# EAGLE schematic Automaton (EAGLE 5.91)
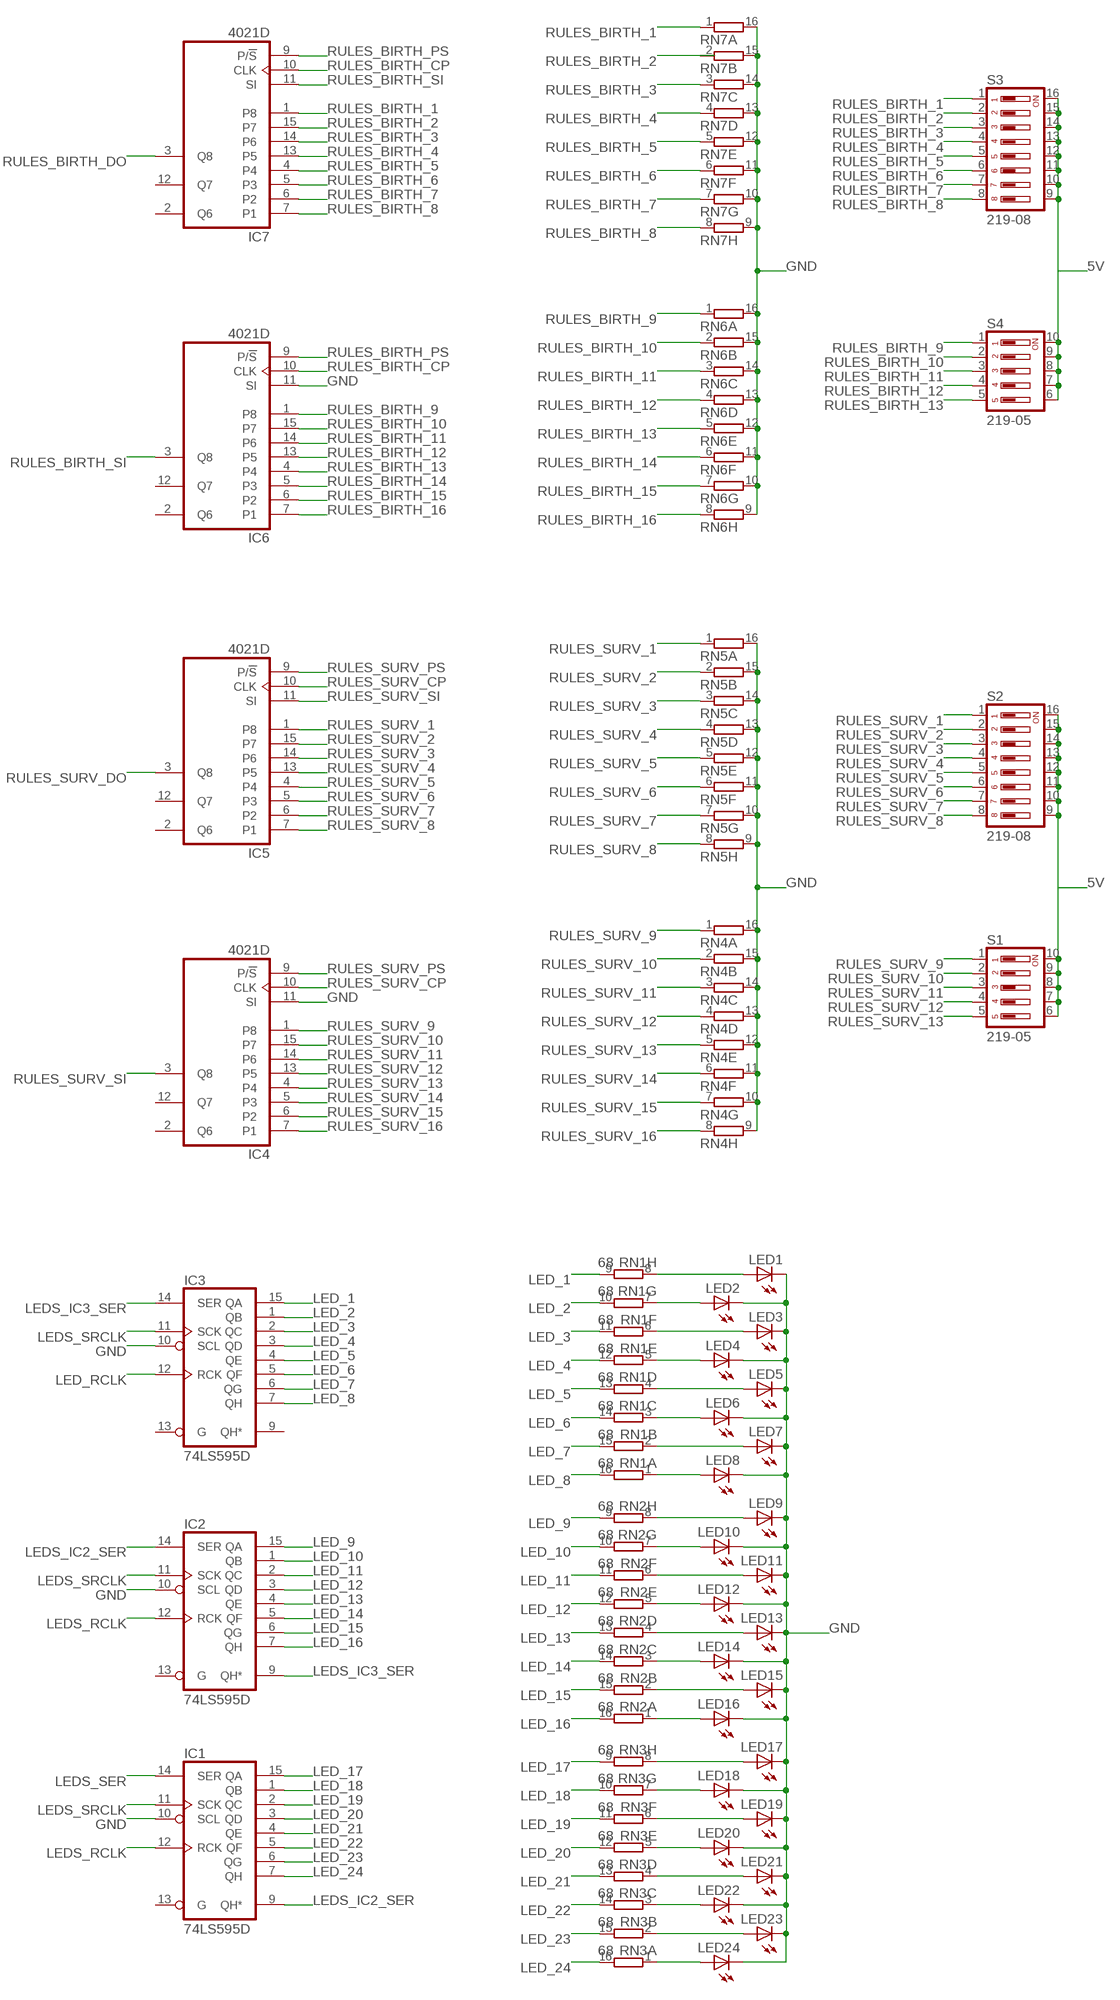
[diagram p0: schematic, sheet 1, part 1 of 2]
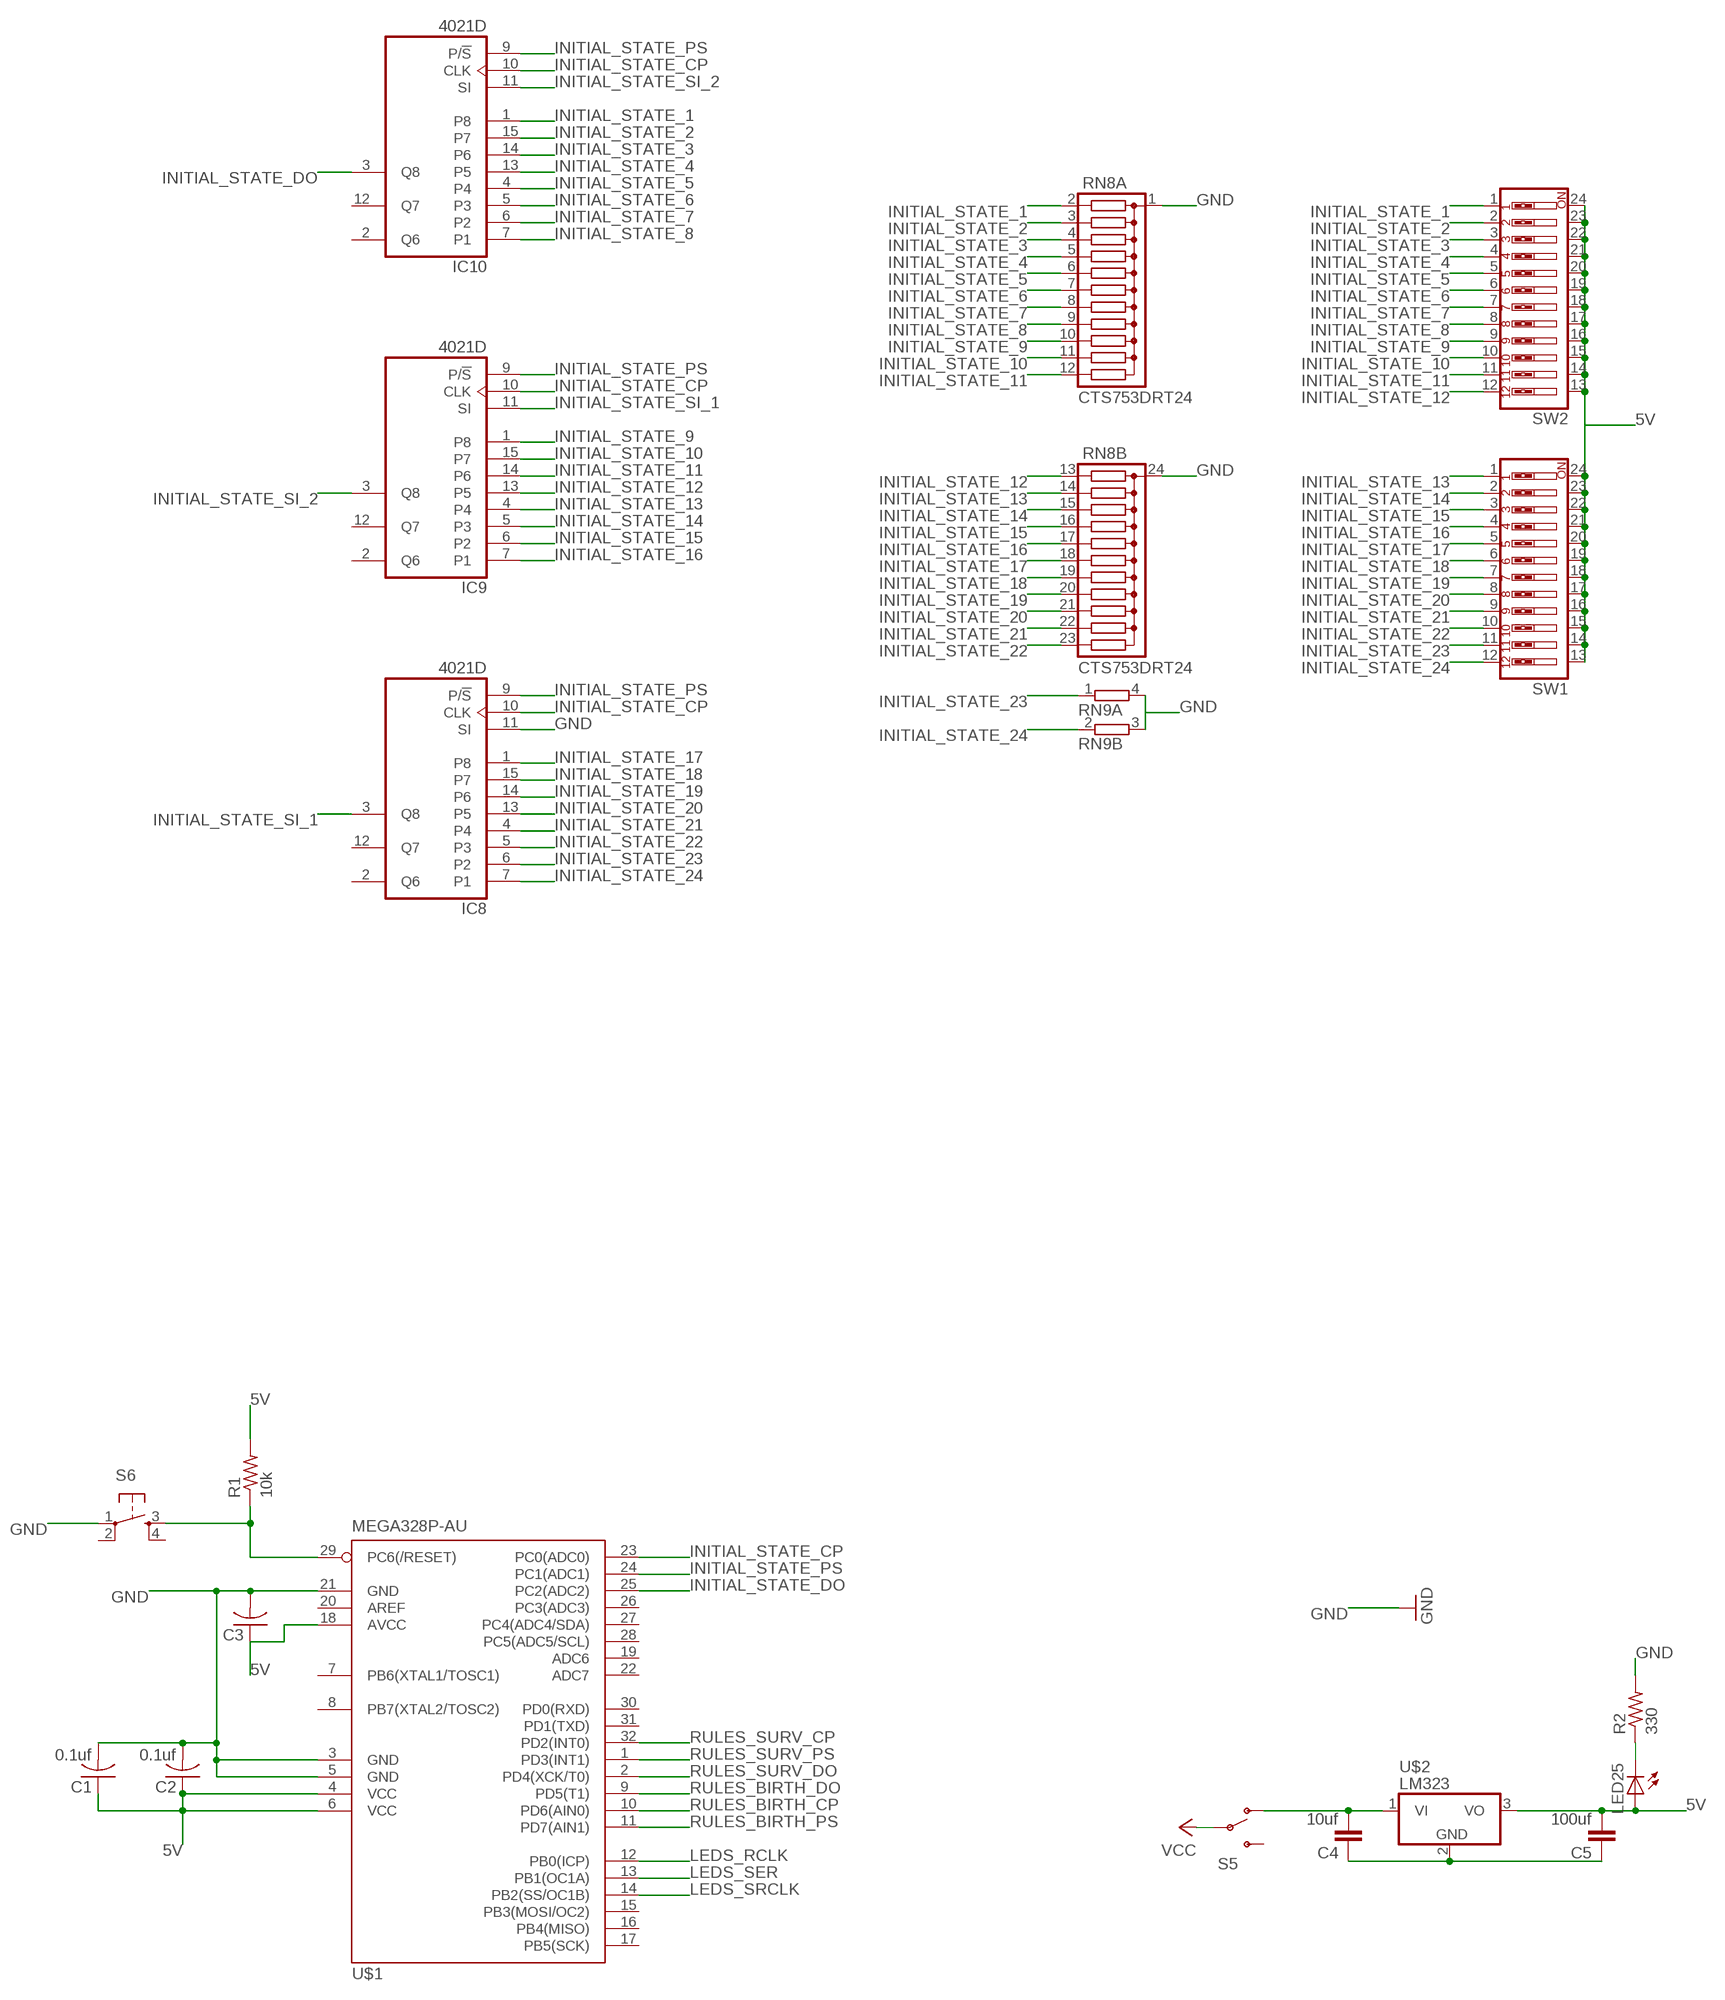
[diagram p1: schematic, sheet 1, part 2 of 2]

## Parts
C1  0.1uf  C-US025-024X044  [C025-024X044]
C2  0.1uf  C-US025-024X044  [C025-024X044]
C3  C-US025-024X044  [C025-024X044]
C4  10uf  CAP1210  [1210]
C5  100uf  CAP1210  [1210]
IC1  74LS595D  [SO16]
IC2  74LS595D  [SO16]
IC3  74LS595D  [SO16]
IC4  4021D  [SO16]
IC5  4021D  [SO16]
IC6  4021D  [SO16]
IC7  4021D  [SO16]
IC8  4021D  [SO16]
IC9  4021D  [SO16]
IC10  4021D  [SO16]
LED1  LED  [SMARTLED-TTW]
LED2  LED  [SMARTLED-TTW]
LED3  LED  [SMARTLED-TTW]
LED4  LED  [SMARTLED-TTW]
LED5  LED  [SMARTLED-TTW]
LED6  LED  [SMARTLED-TTW]
LED7  LED  [SMARTLED-TTW]
LED8  LED  [SMARTLED-TTW]
LED9  LED  [SMARTLED-TTW]
LED10  LED  [SMARTLED-TTW]
LED11  LED  [SMARTLED-TTW]
LED12  LED  [SMARTLED-TTW]
LED13  LED  [SMARTLED-TTW]
LED14  LED  [SMARTLED-TTW]
LED15  LED  [SMARTLED-TTW]
LED16  LED  [SMARTLED-TTW]
LED17  LED  [SMARTLED-TTW]
LED18  LED  [SMARTLED-TTW]
LED19  LED  [SMARTLED-TTW]
LED20  LED  [SMARTLED-TTW]
LED21  LED  [SMARTLED-TTW]
LED22  LED  [SMARTLED-TTW]
LED23  LED  [SMARTLED-TTW]
LED24  LED  [SMARTLED-TTW]
LED25  LED  [SMARTLED-TTW]
R1  10k  R-US_M0805  [M0805]
R2  330  R-US_0204/5  [0204/5]
RN1  68  8R-NSOMC  [SOMC16]
RN2  68  8R-NSOMC  [SOMC16]
RN3  68  8R-NSOMC  [SOMC16]
RN4  8R-NSOMC  [SOMC16]
RN5  8R-NSOMC  [SOMC16]
RN6  8R-NSOMC  [SOMC16]
RN7  8R-NSOMC  [SOMC16]
RN8  CTS753DRT24  [CTS753DRT24]
RN9  2R-NEXBV4V  [EXBV4V]
S1  219-05  [CTS-219-05]
S2  219-08  [CTS-219-08]
S3  219-08  [CTS-219-08]
S4  219-05  [CTS-219-05]
S5  SWITCH-SPSTPTH_LOCK  [SWITCH-SPDT_LOCK.007S]
S6  TAC_SWITCHSMD  [TACTILE_SWITCH_SMD]
SW1  SW_DIP-12  [EDG-12]
SW2  SW_DIP-12  [EDG-12]
U$1  MEGA328P-AU  [TQFP32-08]
U$2  LM323  [TO220H]

## Nets
5V: C1.1 C2.1 C3.1 C5.2 LED25.A@1(A) R1.2 S1.6 S1.7 S1.8 S1.9 S1.10 S2.9 S2.10 S2.11 S2.12 S2.13 S2.14 S2.15 S2.16 S3.9 S3.10 S3.11 S3.12 S3.13 S3.14 S3.15 S3.16 S4.6 S4.7 S4.8 S4.9 S4.10 SW1.13 SW1.14 SW1.15 SW1.16 SW1.17 SW1.18 SW1.19 SW1.20 SW1.21 SW1.22 SW1.23 SW1.24 SW2.13 SW2.14 SW2.15 SW2.16 SW2.17 SW2.18 SW2.19 SW2.20 SW2.21 SW2.22 SW2.23 SW2.24 U$1.4(VCC) U$1.6(VCC) U$1.18(AVCC) U$2.3(VO)
GND: C1.2 C2.2 C3.2 IC1.10(SCL) IC2.10(SCL) IC3.10(SCL) IC4.11(SI) IC6.11(SI) IC8.11(SI) LED1.C@1(C) LED2.C@1(C) LED3.C@1(C) LED4.C@1(C) LED5.C@1(C) LED6.C@1(C) LED7.C@1(C) LED8.C@1(C) LED9.C@1(C) LED10.C@1(C) LED11.C@1(C) LED12.C@1(C) LED13.C@1(C) LED14.C@1(C) LED15.C@1(C) LED16.C@1(C) LED17.C@1(C) LED18.C@1(C) LED19.C@1(C) LED20.C@1(C) LED21.C@1(C) LED22.C@1(C) LED23.C@1(C) LED24.C@1(C) R2.2 RN4.9 RN4.10 RN4.11 RN4.12 RN4.13 RN4.14 RN4.15 RN4.16 RN5.9 RN5.10 RN5.11 RN5.12 RN5.13 RN5.14 RN5.15 RN5.16 RN6.9 RN6.10 RN6.11 RN6.12 RN6.13 RN6.14 RN6.15 RN6.16 RN7.9 RN7.10 RN7.11 RN7.12 RN7.13 RN7.14 RN7.15 RN7.16 RN8.1(A:C) RN8.24(B:C) RN9.3 RN9.4 S6.1 U$1.3(GND) U$1.5(GND) U$1.21(GND)
INITIAL_STATE_1: IC10.1(P8) RN8.2 SW2.1
INITIAL_STATE_2: IC10.15(P7) RN8.3 SW2.2
INITIAL_STATE_3: IC10.14(P6) RN8.4 SW2.3
INITIAL_STATE_4: IC10.13(P5) RN8.5 SW2.4
INITIAL_STATE_5: IC10.4 RN8.6 SW2.5
INITIAL_STATE_6: IC10.5(P3) RN8.7 SW2.6
INITIAL_STATE_7: IC10.6(P2) RN8.8 SW2.7
INITIAL_STATE_8: IC10.7(P1) RN8.9 SW2.8
INITIAL_STATE_9: IC9.1(P8) RN8.10 SW2.9
INITIAL_STATE_10: IC9.15(P7) RN8.11 SW2.10
INITIAL_STATE_11: IC9.14(P6) RN8.12 SW2.11
INITIAL_STATE_12: IC9.13(P5) RN8.13 SW2.12
INITIAL_STATE_13: IC9.4 RN8.14 SW1.1
INITIAL_STATE_14: IC9.5(P3) RN8.15 SW1.2
INITIAL_STATE_15: IC9.6(P2) RN8.16 SW1.3
INITIAL_STATE_16: IC9.7(P1) RN8.17 SW1.4
INITIAL_STATE_17: IC8.1(P8) RN8.18 SW1.5
INITIAL_STATE_18: IC8.15(P7) RN8.19 SW1.6
INITIAL_STATE_19: IC8.14(P6) RN8.20 SW1.7
INITIAL_STATE_20: IC8.13(P5) RN8.21 SW1.8
INITIAL_STATE_21: IC8.4 RN8.22 SW1.9
INITIAL_STATE_22: IC8.5(P3) RN8.23 SW1.10
INITIAL_STATE_23: IC8.6(P2) RN9.1 SW1.11
INITIAL_STATE_24: IC8.7(P1) RN9.2 SW1.12
INITIAL_STATE_CP: IC8.10(CLK) IC9.10(CLK) IC10.10(CLK) U$1.23(PC0(ADC0))
INITIAL_STATE_DO: IC10.3(Q8) U$1.25(PC2(ADC2))
INITIAL_STATE_PS: IC8.9(P/!S) IC9.9(P/!S) IC10.9(P/!S) U$1.24(PC1(ADC1))
INITIAL_STATE_SI_1: IC8.3(Q8) IC9.11(SI)
INITIAL_STATE_SI_2: IC9.3(Q8) IC10.11(SI)
LED_1: IC3.15(QA) RN1.9
LED_2: IC3.1(QB) RN1.10
LED_3: IC3.2(QC) RN1.11
LED_4: IC3.3(QD) RN1.12
LED_5: IC3.4(QE) RN1.13
LED_6: IC3.5(QF) RN1.14
LED_7: IC3.6(QG) RN1.15
LED_8: IC3.7(QH) RN1.16
LED_9: IC2.15(QA) RN2.9
LED_10: IC2.1(QB) RN2.10
LED_11: IC2.2(QC) RN2.11
LED_12: IC2.3(QD) RN2.12
LED_13: IC2.4(QE) RN2.13
LED_14: IC2.5(QF) RN2.14
LED_15: IC2.6(QG) RN2.15
LED_16: IC2.7(QH) RN2.16
LED_17: IC1.15(QA) RN3.9
LED_18: IC1.1(QB) RN3.10
LED_19: IC1.2(QC) RN3.11
LED_20: IC1.3(QD) RN3.12
LED_21: IC1.4(QE) RN3.13
LED_22: IC1.5(QF) RN3.14
LED_23: IC1.6(QG) RN3.15
LED_24: IC1.7(QH) RN3.16
LED_RCLK: IC3.12(RCK)
LEDS_IC2_SER: IC1.9(QH*) IC2.14(SER)
LEDS_IC3_SER: IC2.9(QH*) IC3.14(SER)
LEDS_RCLK: IC1.12(RCK) IC2.12(RCK) U$1.12(PB0(ICP))
LEDS_SER: IC1.14(SER) U$1.13(PB1(OC1A))
LEDS_SRCLK: IC1.11(SCK) IC2.11(SCK) IC3.11(SCK) U$1.14(PB2(SS/OC1B))
N$1: LED24.A@1(A) RN3.1
N$2: C4.2 S5.1(O) U$2.1(VI)
N$3: LED23.A@1(A) RN3.2
N$4: C4.1 C5.1 U$2.2(GND)
N$5: LED22.A@1(A) RN3.3
N$6: LED21.A@1(A) RN3.4
N$7: LED20.A@1(A) RN3.5
N$8: LED19.A@1(A) RN3.6
N$9: LED18.A@1(A) RN3.7
N$10: LED17.A@1(A) RN3.8
N$11: LED16.A@1(A) RN2.1
N$12: LED15.A@1(A) RN2.2
N$13: LED14.A@1(A) RN2.3
N$14: LED13.A@1(A) RN2.4
N$15: LED12.A@1(A) RN2.5
N$16: LED11.A@1(A) RN2.6
N$17: LED10.A@1(A) RN2.7
N$18: LED9.A@1(A) RN2.8
N$19: LED8.A@1(A) RN1.1
N$20: LED7.A@1(A) RN1.2
N$21: LED6.A@1(A) RN1.3
N$22: LED5.A@1(A) RN1.4
N$23: LED4.A@1(A) RN1.5
N$24: LED3.A@1(A) RN1.6
N$25: LED2.A@1(A) RN1.7
N$26: LED1.A@1(A) RN1.8
N$27: LED25.C@1(C) R2.1
N$32: R1.1 S6.3 U$1.29(PC6(/RESET))
RULES_BIRTH_1: IC7.1(P8) RN7.1 S3.1
RULES_BIRTH_2: IC7.15(P7) S3.2
RULES_BIRTH_3: IC7.14(P6) RN7.3 S3.3
RULES_BIRTH_4: IC7.13(P5) RN7.4 S3.4
RULES_BIRTH_5: IC7.4 RN7.5 S3.5
RULES_BIRTH_6: IC7.5(P3) RN7.6 S3.6
RULES_BIRTH_7: IC7.6(P2) RN7.7 S3.7
RULES_BIRTH_8: IC7.7(P1) RN7.8 S3.8
RULES_BIRTH_9: IC6.1(P8) RN6.1 S4.1
RULES_BIRTH_10: IC6.15(P7) RN6.2 S4.2
RULES_BIRTH_11: IC6.14(P6) RN6.3 S4.3
RULES_BIRTH_12: IC6.13(P5) RN6.4 S4.4
RULES_BIRTH_13: IC6.4 RN6.5 S4.5
RULES_BIRTH_14: IC6.5(P3) RN6.6
RULES_BIRTH_15: IC6.6(P2) RN6.7
RULES_BIRTH_16: IC6.7(P1) RN6.8
RULES_BIRTH_CP: IC6.10(CLK) IC7.10(CLK) U$1.10(PD6(AIN0))
RULES_BIRTH_DO: IC7.3(Q8) U$1.9(PD5(T1))
RULES_BIRTH_PS: IC6.9(P/!S) IC7.9(P/!S) U$1.11(PD7(AIN1))
RULES_BIRTH_SI: IC6.3(Q8) IC7.11(SI)
RULES_SURV_1: IC5.1(P8) RN5.1 S2.1
RULES_SURV_2: IC5.15(P7) RN5.2 S2.2
RULES_SURV_3: IC5.14(P6) RN5.3 S2.3
RULES_SURV_4: IC5.13(P5) RN5.4 S2.4
RULES_SURV_5: IC5.4 RN5.5 S2.5
RULES_SURV_6: IC5.5(P3) RN5.6 S2.6
RULES_SURV_7: IC5.6(P2) RN5.7 S2.7
RULES_SURV_8: IC5.7(P1) RN5.8 S2.8
RULES_SURV_9: IC4.1(P8) RN4.1 S1.1
RULES_SURV_10: IC4.15(P7) RN4.2 S1.2
RULES_SURV_11: IC4.14(P6) RN4.3 S1.3
RULES_SURV_12: IC4.13(P5) RN4.4 S1.4
RULES_SURV_13: IC4.4 RN4.5 S1.5
RULES_SURV_14: IC4.5(P3) RN4.6
RULES_SURV_15: IC4.6(P2) RN4.7
RULES_SURV_16: IC4.7(P1) RN4.8
RULES_SURV_CP: IC4.10(CLK) IC5.10(CLK) U$1.32(PD2(INT0))
RULES_SURV_DO: IC5.3(Q8) U$1.2(PD4(XCK/T0))
RULES_SURV_PS: IC4.9(P/!S) IC5.9(P/!S) U$1.1(PD3(INT1))
RULES_SURV_SI: IC4.3(Q8) IC5.11(SI)
VCC: S5.2(P)
Unconnected: IC1.13(G) IC2.13(G) IC3.9(QH*) IC3.13(G) IC4.2(Q6) IC4.12(Q7) IC5.2(Q6) IC5.12(Q7) IC6.2(Q6) IC6.12(Q7) IC7.2(Q6) IC7.12(Q7) IC8.2(Q6) IC8.12(Q7) IC9.2(Q6) IC9.12(Q7) IC10.2(Q6) IC10.12(Q7) RN7.2 S5.3(S) S6.2 S6.4 U$1.7(PB6(XTAL1/TOSC1)) U$1.8(PB7(XTAL2/TOSC2)) U$1.15(PB3(MOSI/OC2)) U$1.16(PB4(MISO)) U$1.17(PB5(SCK)) U$1.19(ADC6) U$1.20(AREF) U$1.22(ADC7) U$1.26(PC3(ADC3)) U$1.27(PC4(ADC4/SDA)) U$1.28(PC5(ADC5/SCL)) U$1.30(PD0(RXD)) U$1.31(PD1(TXD))

## Power pins joined to a net without a drawn wire
GND: IC1.8(GND) IC2.8(GND) IC3.8(GND)
VCC: IC1.16(VCC) IC2.16(VCC) IC3.16(VCC)
VDD: IC4.16(VDD) IC5.16(VDD) IC6.16(VDD) IC7.16(VDD) IC8.16(VDD) IC9.16(VDD) IC10.16(VDD)
VSS: IC4.8(VSS) IC5.8(VSS) IC6.8(VSS) IC7.8(VSS) IC8.8(VSS) IC9.8(VSS) IC10.8(VSS)

## Library data of the parts
C1-C3 = resistor:C-US: CAPACITOR, American symbol
C4 C5 = SparkFun:CAP: Capacitor Standard 0603 ceramic capacitor, and 0.1" leaded capacitor.
IC1-IC3 = 74xx-us:74*595: 8-bit SHIFT REGISTER, output latch
IC4-IC10 = 40xx:4021: 8-bit static SHIFT REGISTER
LED1-LED25 = led:LED: LED OSRAM: - CHIPLED LG R971, LG N971, LY N971, LG Q971, LY Q971, LO R971, LY R971 LH N974, LH R974 LS Q976, LO Q976, LY Q976 LO Q996 - Hyper CHIPLED LW Q18S LB Q993, LB Q99A, LB R99A - SideLED LS A670, LO A670, LY A670, LG A670, LP A670 LB A673, LV A673, LT A673, LW A673 LH A674 LY A675 LS A676, LA A676, LO A676, LY A676, LW A676 LS A679, LY A679, LG A679 - Hyper Micro SIDELED® LS Y876, LA Y876, LO Y876, LY Y876 LT Y87S - SmartLED LW L88C, LW L88S LB L89C, LB L89S, LG L890 LS L89K, LO L89K, LY L89K LS L896, LA L896, LO L896, LY L896 - TOPLED LS T670, LO T670, LY T670, LG T670, LP T670 LSG T670, LSP T670, LSY T670, LOP T670, LYG T670 LG T671, LOG T671, LSG T671 LB T673, LV T673, LT T673, LW T673 LH T674 LS T676, LA T676, LO T676, LY T676, LB T676, LH T676, LSB T676, LW T676 LB T67C, LV T67C, LT T67C, LS T67K, LO T67K, LY T67K, LW E67C LS E67B, LA E67B, LO E67B, LY E67B, LB E67C, LV E67C, LT E67C LW T67C LS T679, LY T679, LG T679 LS T770, LO T770, LY T770, LG T770, LP T770 LB T773, LV T773, LT T773, LW T773 LH T774 LS E675, LA E675, LY E675, LS T675 LS T776, LA T776, LO T776, LY T776, LB T776 LHGB T686 LT T68C, LB T68C - Hyper Mini TOPLED® LB M676 - Mini TOPLED Santana® LG M470 LS M47K, LO M47K, LY M47K Source: http://www.osram.convergy.de LUXEON: - LUMILED® LXK2-PW12-R00, LXK2-PW12-S00, LXK2-PW14-U00, LXK2-PW14-V00 LXK2-PM12-R00, LXK2-PM12-S00, LXK2-PM14-U00 LXK2-PE12-Q00, LXK2-PE12-R00, LXK2-PE12-S00, LXK2-PE14-T00, LXK2-PE14-U00 LXK2-PB12-K00, LXK2-PB12-L00, LXK2-PB12-M00, LXK2-PB14-N00, LXK2-PB14-P00, LXK2-PB14-Q00 LXK2-PR12-L00, LXK2-PR12-M00, LXK2-PR14-Q00, LXK2-PR14-R00 LXK2-PD12-Q00, LXK2-PD12-R00, LXK2-PD12-S00 LXK2-PH12-R00, LXK2-PH12-S00 LXK2-PL12-P00, LXK2-PL12-Q00, LXK2-PL12-R00 Source: www.luxeon.com KINGBRIGHT: KA-3528ASYC Source: www.kingbright.com
R1 R2 = resistor:R-US_: RESISTOR, American symbol
RN1-RN7 = resistor-dil:8R-N: DIL RESISTOR; OC_FARNELL: unknown; OC_NEWARK: unknown
RN8 = resistor-net:CTS753DRT24: Network Resistor CTS 753 Series Leadless Surface Mount Source: http://www.ctscorp.com/components/Datasheets/753.pdf Distributor: Digi Key; OC_FARNELL: unknown; OC_NEWARK: unknown
RN9 = resistor-dil:2R-N: Array Chip Resistor Source: Panasonic; OC_FARNELL: unknown; OC_NEWARK: unknown
S1 S4 = switch-dil:219-05*: Surface Mount DIP Switch Series 219 SMT CTS Electronic Components Sourc: www.ctscorp.com; OC_FARNELL: unknown; OC_NEWARK: unknown
S2 S3 = switch-dil:219-08*: Surface Mount DIP Switch Series 219 SMT CTS Electronic Components Sourc: www.ctscorp.com; OC_FARNELL: unknown; OC_NEWARK: unknown
S5 = SparkFun:SWITCH-SPST: SPST Switch Simple slide switch. Spark Fun Electronics SKU : COM-00102
S6 = SparkFun:TAC_SWITCH: Momentary Switch Button commonly used for reset or general input. Spark Fun Electronics SKU : COM-00097
SW1 SW2 = special:SW_DIP-12: DIP SWITCH
U$1 = MyAtmel:MEGA328P
U$2 = MyLib:LM323